# Altium project 50AN_DIGI.PrjPcb
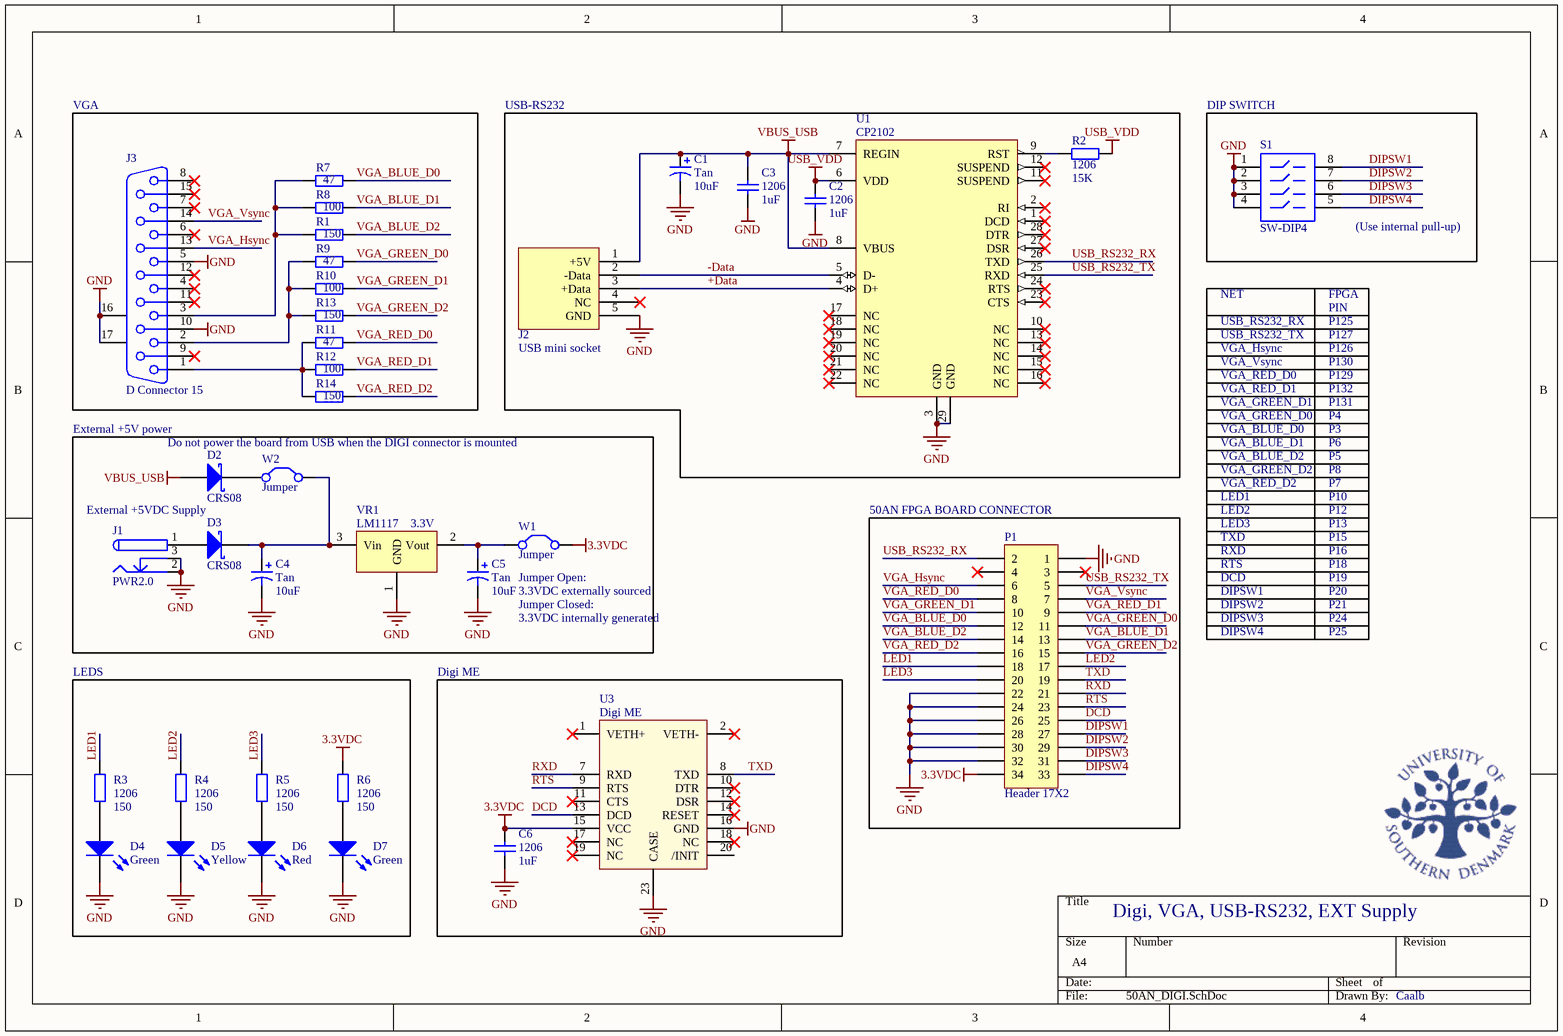
[diagram p0: 50AN_DIGI.SchDoc]
1 sheet, 36 parts. Net scope: global (net labels, ports and power ports of the same name join across sheets).
Board file: 50AN Digi.PcbDoc

## Sheet 50AN_DIGI.SchDoc
size A4

### Parts
C1  Tan  value 10uF  [Tantal size A]
C2  1206  value 1uF  [1206C]
C3  1206  value 1uF  [1206C]
C4  Tan  value 10uF  [Tantal size A]
C5  Tan  value 10uF  [Tantal size A]
C6  1206  value 1uF  [1206C]
D2  CRS08  [CRS08]
D3  CRS08  [CRS08]
D4  Green  [LED1206G]
D5  Yellow  [LED1206Y]
D6  Red  [LED1206R]
D7  Green  [LED1206G]
J1  PWR2.0  [DC FATN Ø2.0]
J2  USB mini socket  [Mini USB SMD F:1243250]
J3  D Connector 15  [HDSUB 15]
P1  Header 17X2  [50AN HDR2X17]
R1  value 150  [1206R]  (hidden comment: 1206)
R2  1206  value 15K  [1206R]
R3  1206  value 150  [1206R]
R4  1206  value 150  [1206R]
R5  1206  value 150  [1206R]
R6  1206  value 150  [1206R]
R7  value 47  [1206R]  (hidden comment: 1206)
R8  value 100  [1206R]  (hidden comment: 1206)
R9  value 47  [1206R]  (hidden comment: 1206)
R10  value 100  [1206R]  (hidden comment: 1206)
R11  value 47  [1206R]  (hidden comment: 1206)
R12  value 100  [1206R]  (hidden comment: 1206)
R13  value 150  [1206R]  (hidden comment: 1206)
R14  value 150  [1206R]  (hidden comment: 1206)
S1  SW-DIP4  [DIP SW 4]
U1  CP2102  [MLP-28]
U3  Digi ME  [Digi Connect ME]
VR1  LM1117  value 3.3V  [SOT-223]
W1  Jumper  [HDR1X2]
W2  Jumper  [HDR1X2]

### Blocks framed on the sheet
VGA: J3 R1 R7-R14
USB-RS232: C1-C3 J2 R2 U1
50AN FPGA BOARD CONNECTOR: P1
LEDS: D4-D7 R3-R6
Digi ME: C6 U3

### Nets
3.3VDC: C6.2 P1.34 R6.1 U3.15(VCC) W1.2(C2)
GND: C1.2 C2.1 C3.1 C4.2 C5.2 C6.1 D4.2(K) D5.2(K) D6.2(K) D7.2(K) J1.2 J1.3 J2.5(GND) J3.5 J3.10 J3.16(MH1) J3.17(MH2) P1.1 P1.22 P1.24 P1.26 P1.28 P1.30 P1.32 S1.1 S1.2 S1.3 S1.4 U1.3(GND) U1.29(GND) U3.16(GND) U3.23(CASE) VR1.1(GND)
USB_VDD: C2.2 R2.1 U1.6(VDD)
VBUS_USB: C1.1 C3.2 D2.1(A) J2.1(+5V) U1.7(REGIN) U1.8(VBUS)
+Data: J2.3(+Data) U1.4(D+)
-Data: J2.2(-Data) U1.5(D-)
DCD: P1.25 U3.13(DCD)
DIPSW1: P1.27 S1.8
DIPSW2: P1.29 S1.7
DIPSW3: P1.31 S1.6
DIPSW4: P1.33 S1.5
LED1: P1.18 R3.1
LED2: P1.17 R4.1
LED3: P1.20 R5.1
RTS: P1.23 U3.9(RTS)
RXD: P1.21 U3.7(RXD)
TXD: P1.19 U3.8(TXD)
USB_RS232_RX: P1.2 U1.26(TXD)
USB_RS232_TX: P1.5 U1.25(RXD)
VGA_BLUE_D0: P1.12 R7.1
VGA_BLUE_D1: P1.13 R8.1
VGA_BLUE_D2: P1.14 R1.1
VGA_GREEN_D0: P1.11 R9.1
VGA_GREEN_D1: P1.10 R10.1
VGA_GREEN_D2: P1.15 R13.1
VGA_Hsync: J3.13 P1.6
VGA_RED_D0: P1.8 R11.1
VGA_RED_D1: P1.9 R12.1
VGA_RED_D2: P1.16 R14.1
VGA_Vsync: J3.14 P1.7
NetC4_1: C4.1 D3.2(K) VR1.3(Vin) W2.2(C2)
NetC5_1: C5.1 VR1.2(Vout) W1.1(C1)
NetD2_2: D2.2(K) W2.1(C1)
NetD3_1: D3.1(A) J1.1
NetD4_1: D4.1(A) R3.2
NetD5_1: D5.1(A) R4.2
NetD6_1: D6.1(A) R5.2
NetD7_1: D7.1(A) R6.2
NetJ3_1: J3.1 R11.2 R12.2 R14.2
NetJ3_2: J3.2 R9.2 R10.2 R13.2
NetJ3_3: J3.3 R1.2 R7.2 R8.2
NetR2_2: R2.2 U1.9(RST)

Not connected (* = marked no-connect by the designer): J2 4(NC)*; J3 4* 6* 7* 8* 9* 11* 12* 15*; P1 3* 4*; U1 1(DCD)* 2(RI)* 10(NC)* 11(SUSPEND)* 12(SUSPEND)* 13(NC)* 14(NC)* 15(NC)* 16(NC)* 17(NC)* 18(NC)* 19(NC)* 20(NC)* 21(NC)* 22(NC)* 23(CTS)* 24(RTS)* 27(DSR)* 28(DTR)*; U3 1(VETH+)* 2(VETH-)* 10(DTR)* 11(CTS)* 12(DSR)* 14(RESET)* 17(NC)* 18(NC)* 19(NC)* 20(/INIT)

### Notes on the sheet
- DIP SWITCH
- (near S1) (Use internal pull-up)
- NET
- FPGA
- PIN
- USB_RS232_RX
- USB_RS232_TX
- VGA_Hsync
- VGA_Vsync
- VGA_RED_D0
- P125
- P127
- P126
- P130
- P129
- External +5V power
- Do not power the board from USB when the DIGI connector is mounted
- VGA_RED_D1
- VGA_GREEN_D1
- VGA_GREEN_D0
- VGA_BLUE_D0
- VGA_BLUE_D1
- P132
- P131
- P4
- P3
- P6
- External +5VDC Supply
- LED1
- LED2
- VGA_GREEN_D2
- VGA_BLUE_D2
- VGA_RED_D2
- P5
- P8
- P7
- P12
- P10
- Jumper Open:
- LED3
- TXD
- RXD
- RTS
- DCD
- P18
- P15
- P16
- P19
- P13
- Jumper Closed:
- 3.3VDC externally sourced
- 3.3VDC internally generated
- DIPSW1
- DIPSW2
- DIPSW3
- DIPSW4
- P20
- P21
- P24
- P25
- Digi, VGA, USB-RS232, EXT Supply
- Caalb

### Library data of the parts
C1 C4 C5 = Cap Pol1: Polarized Capacitor (Radial); Dist: Farnell: 1658029; Dist: Lager; Published: 8-Jun-2000; LatestRevisionDate: 17-Jul-2002; LatestRevisionNote: Re-released for DXP Platform.; PackageReference: RB7.6-15; Publisher: Altium Limited
C2 C3 C6 = Cap: Capacitor; Dist: Lager; Published: 8-Jun-2000; LatestRevisionDate: 17-Jul-2002; LatestRevisionNote: Re-released for DXP Platform.; PackageReference: RAD-0.3; Publisher: Altium Limited
D2 D3 = Diode 11DQ03: Schottky Rectifier; Dist: Farnell: 1300796 / Digikey: CRS08QMCT-ND; Published: 8-Jun-2000; LatestRevisionDate: 17-Jul-2002; LatestRevisionNote: Re-released for DXP Platform.; DatasheetDocument: Dec-1997; PackageReference: DO-204AL; Publisher: Altium Limited; Code_JEDEC: DO-204-AL; ComponentLink1Description: Manufacturer Link; ComponentLink1URL: http://www.irf.com/; ComponentLink2Description: Datasheet; ComponentLink2URL: http://www.irf.com/product-info/datasheets/data/11dq03.pdf; Supplier Part Number: CRS08QMCT-ND
D4-D7 = LED0: Dist: Lager; Published: 8-Jun-2000; LatestRevisionDate: 08-Jul-2005; LatestRevisionNote: Mech Layer 1 removed.; PackageReference: LED-0; Publisher: Altium Limited
J1 = PWR2.5: Low Voltage Power Supply Connector; Dist: Lager; Published: 17-Dec-2003; DatasheetDocument: 09-May-2002; Publisher: Altium Limited; ComponentLink1Description: Manufacturer Link; ComponentLink1URL: http://domino.kycon.com/internet/Products.html
J2 = USB mini socket: Manufacturer Part Number: 2486 01; Manufacturer: LUMBERG; Dist: Farnell: 1243250; Voltage Rating AC: 5; Description: LUMBERG - 2486 01 - SOCKET, MINI, USB, B-TYPE, SMT; Current Rating: 0.5; Test Voltage: 100; No. of Ways: 5; Contact Plating: Gold; Category: Connectors; Supplier Part Number: 1243250; Supplier: Farnell; Connector Type: USB; Termination Method: Solder; Mounting Type: Surface Mount; Gender: Socket; RoHS: YES; ComponentLink1URL: http://www.farnell.com/datasheets/41033.pdf; ComponentLink1Description: http://www.farnell.com/datasheets/41033.pdf
J3 = D Connector 15: Receptacle Assembly, 15 Position, Right Angle; PackageDocument: O; Positions: 15; Dist: Lager; Published: 15-Jun-2001; LatestRevisionDate: 17-Jul-2002; LatestRevisionNote: Re-released for DXP Platform.; DatasheetDocument: 1-Sep-99; PackageReference: 788757; Publisher: Altium Limited; Orientation: Right Angle; Gender: Receptacle
P1 = Header 17X2: Header, 17-Pin, Dual row; Dist: Lager; LatestRevisionDate: 17-Jul-2002; LatestRevisionNote: Re-released for DXP Platform.; Publisher: Altium Limited
R1-R14 = Res2: Resistor; Dist: Lager; Published: 8-Jun-2000; LatestRevisionDate: 17-Jul-2002; LatestRevisionNote: Re-released for DXP Platform.; PackageReference: AXIAL-0.4; Publisher: Altium Limited
S1 = SW-DIP4: DIP Switch; Dist: Lager; Published: 24-Mar-1999; LatestRevisionDate: 17-Jul-2002; LatestRevisionNote: Re-released for DXP Platform.; PackageReference: DIP-8; Publisher: Altium Limited
U1 = CP2102: USB-TO-UART BRIDGE; Manufacturer: Silicon Laboratories  Inc; Manufacturer Part Number: CP2102-GM; Dist: Farnell: 9282130 / Digikey: 336-1160-ND; Description: IC USB-TO-UART BRIDGE 28MLP; Interface: UART; Voltage - Supply: 3 V ~ 3.6 V; ComponentLink1URL: https://www.silabs.com/Support%20Documents/TechnicalDocs/cp2102.pdf; ComponentLink1Description: https://www.silabs.com/Support%20Documents/TechnicalDocs/cp2102.pdf; Supplier Part Number: 336-1160-ND; Category: Integrated Circuits (ICs); Supplier: Digi-Key; RoHS: RoHS Compliant; Applications: USB; Package / Case: 28-QFN (28-MLP); Packaging: Tube
U3 = Digi ME: Digi One ME connector; Dist: Lager
VR1 = LM1117: 800mA Low-Dropout Linear Regulator; Manufacturer Part Number: LM1117IMP-3.3; Manufacturer: NATIONAL SEMICONDUCTOR; Description: NATIONAL SEMICONDUCTOR - LM1117IMP-3.3 - Linear Voltage Regulator IC; Voltage Regulator Type: Positive Fixed LDO; Max Input Voltage: 15; Max Output Current: 800; No. of Pins: 3; Dist: Farnell: 7614123 / Digikey: LM1117MP-3.3CT-ND; Supplier Part Number: LM1117MP-3.3CT-ND; RoHS: NO; Category: Semiconductors - ICs; Termination Type: SMD; Case Style: SOT-223; Operating Temperature Range: -; ComponentLink1URL: http://www.farnell.com/datasheets/10195.pdf; ComponentLink1Description: http://www.farnell.com/datasheets/10195.pdf; ComponentLink2URL: http://www.national.com/models/spice/LM/LM111.MOD; ComponentLink2Description: http://www.national.com/models/spice/LM/LM111.MOD
W1 W2 = Jumper: Jumper Wire; Dist: Lager; Published: 24-Mar-1999; LatestRevisionDate: 17-Jul-2002; LatestRevisionNote: Re-released for DXP Platform.; PackageReference: RAD-0.2; Publisher: Altium Limited